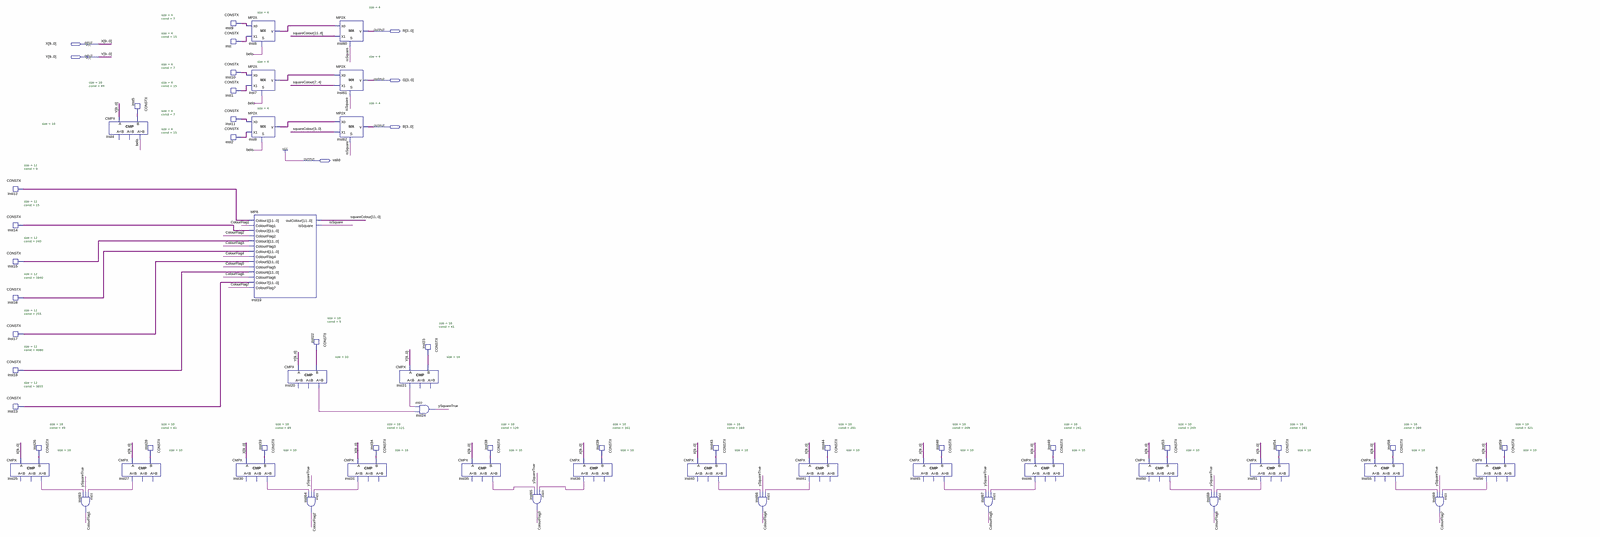
[diagram p0: schematic sheet, whole]
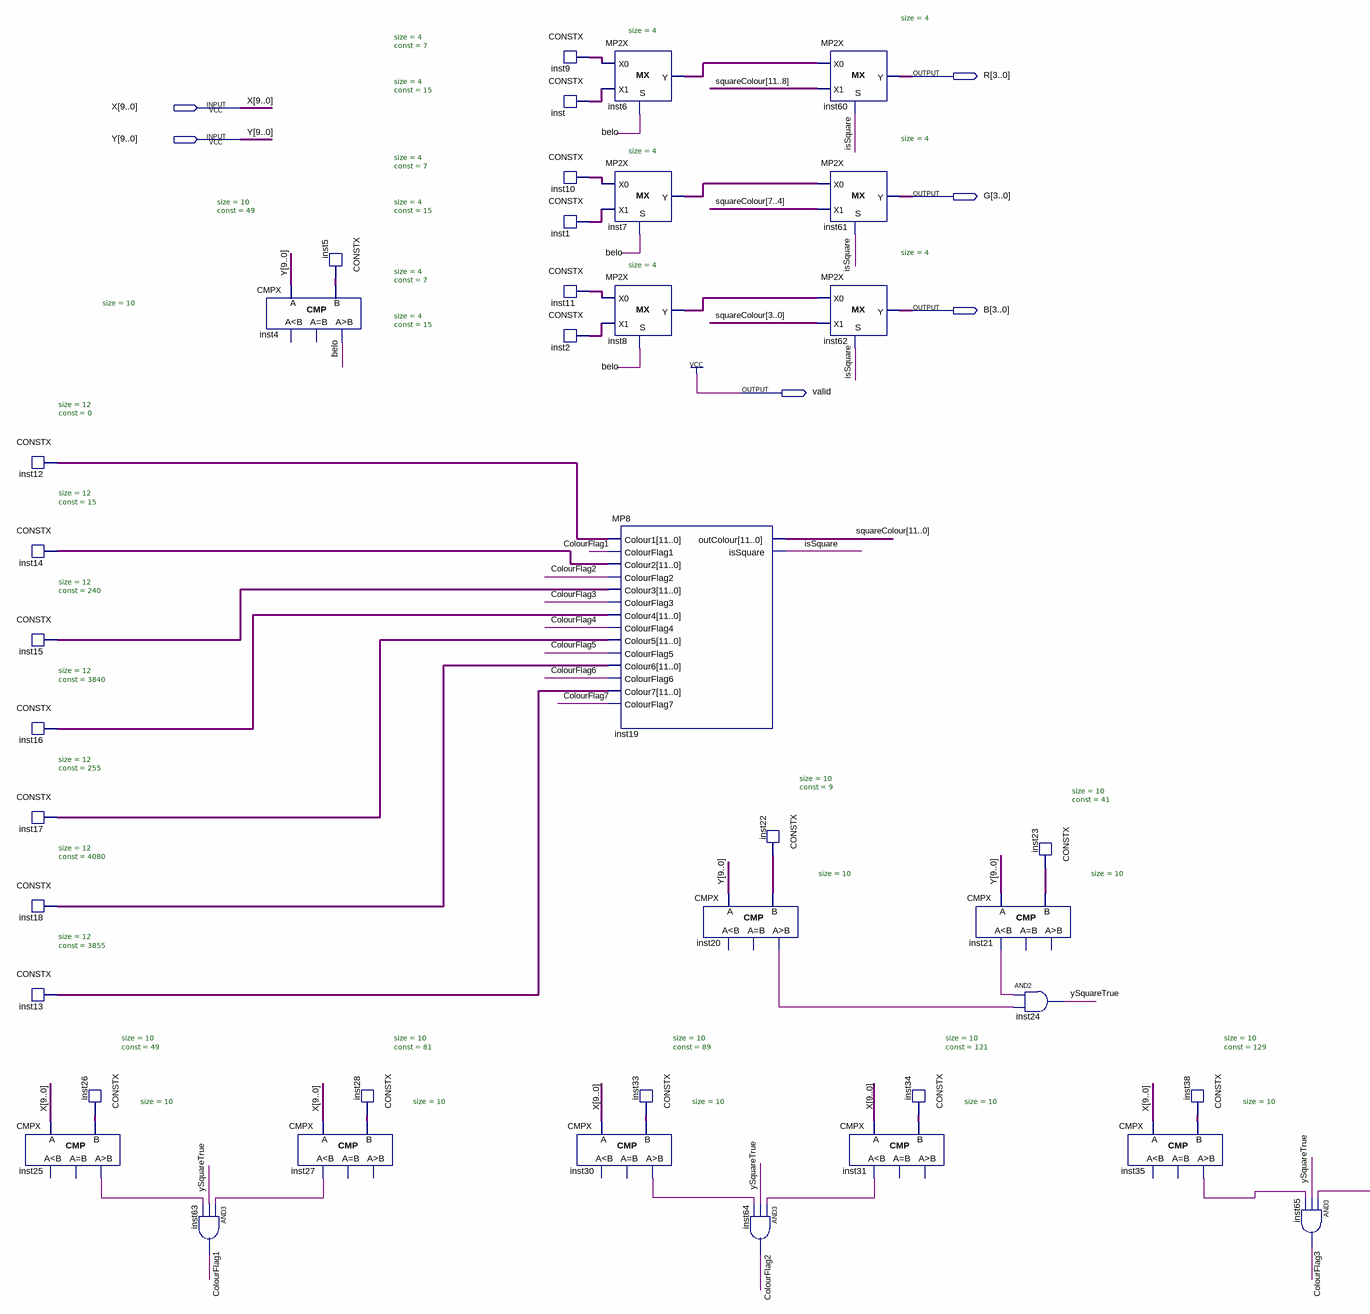
[diagram p1: schematic sheet, left part]
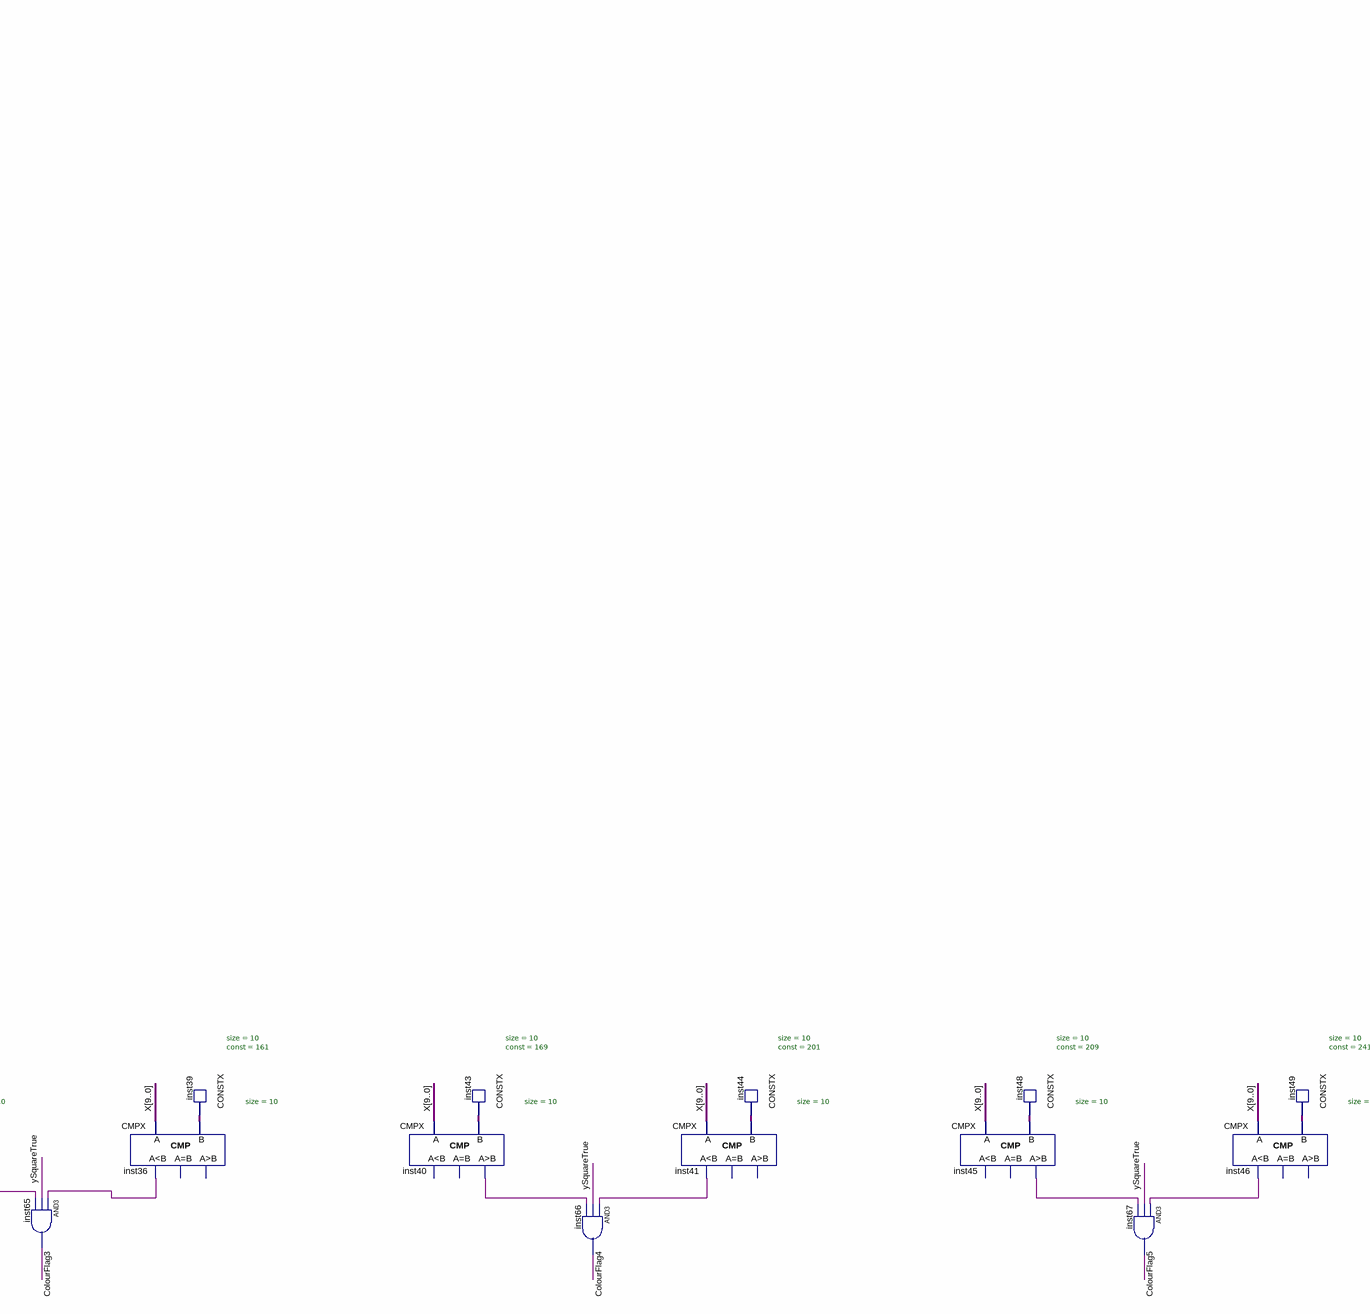
[diagram p2: schematic sheet, centre part]
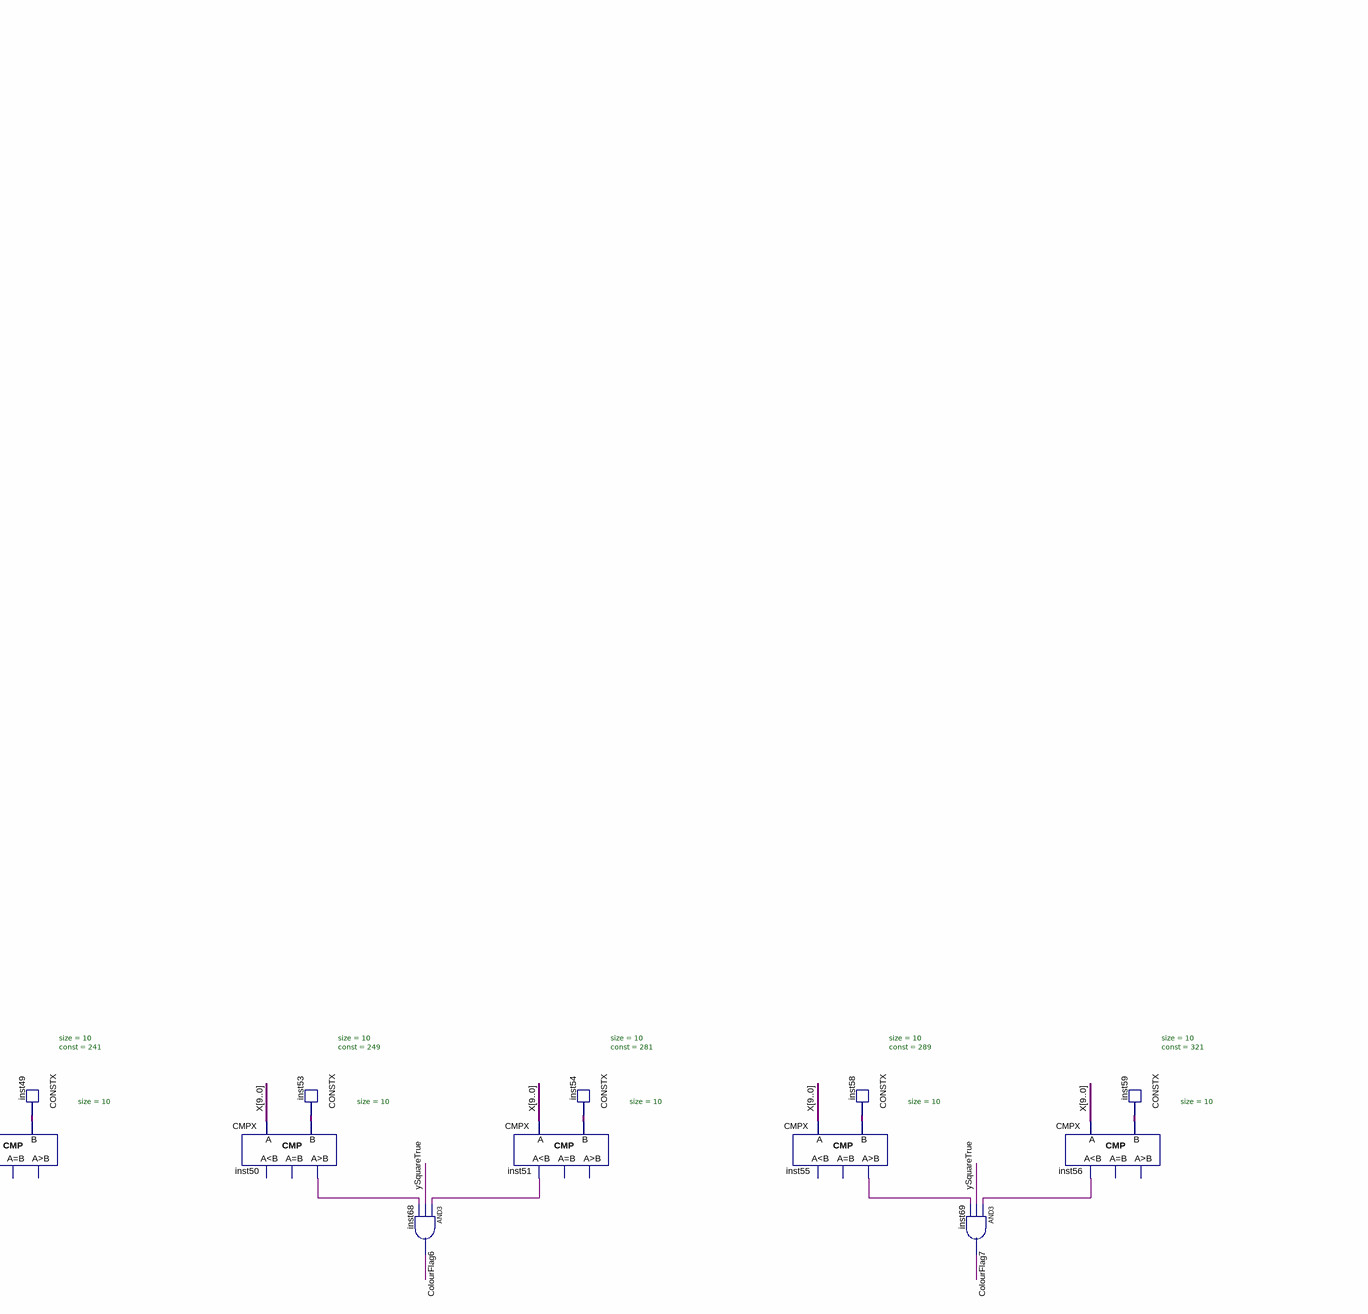
[diagram p3: schematic sheet, right part]
// Quartus schematic Layer0.bdf as structural Verilog: 62 symbols, 6 pins
module Layer0 (
  input  [9:0] X,
  input  [9:0] Y,
  output [3:0] R,
  output [3:0] G,
  output [3:0] B,
  output valid
);

  wire belo, ColourFlag1, ColourFlag2, ColourFlag3, ColourFlag4, ColourFlag5, ColourFlag6, ColourFlag7,
       inst20_gr, inst21_ls, inst25_gr, inst27_ls, inst30_gr, inst31_ls, inst35_gr, inst36_ls, inst40_gr,
       inst41_ls, inst45_gr, inst46_ls, inst50_gr, inst51_ls, inst55_gr, inst56_ls, isSquare, ySquareTrue;
  wire [3:0] inst1_data, inst2_data, inst6_y, inst7_y, inst8_y, inst9_data, inst10_data, inst11_data,
       inst_data;
  wire [9:0] inst5_data, inst22_data, inst23_data, inst26_data, inst28_data, inst33_data, inst34_data,
       inst38_data, inst39_data, inst43_data, inst44_data, inst48_data, inst49_data, inst53_data,
       inst54_data, inst58_data, inst59_data;
  wire [11:0] inst12_data, inst13_data, inst14_data, inst15_data, inst16_data, inst17_data, inst18_data,
       squareColour;

  CONSTX #(.size(12), .\const (0)) inst12 (.data(inst12_data));
  CONSTX #(.size(12), .\const (15)) inst14 (.data(inst14_data));
  CONSTX #(.size(12), .\const (240)) inst15 (.data(inst15_data));
  CONSTX #(.size(12), .\const (3840)) inst16 (.data(inst16_data));
  CONSTX #(.size(12), .\const (255)) inst17 (.data(inst17_data));
  CONSTX #(.size(12), .\const (4080)) inst18 (.data(inst18_data));
  CONSTX #(.size(12), .\const (3855)) inst13 (.data(inst13_data));
  CMPX #(.size(10)) inst25 (.A(X), .B(inst26_data), .gr(inst25_gr));  // open: ls, eq
  CONSTX #(.size(10), .\const (49)) inst26 (.data(inst26_data));
  and inst63 (ColourFlag1, inst27_ls, ySquareTrue, inst25_gr);
  CMPX #(.size(10)) inst4 (.A(Y), .B(inst5_data), .gr(belo));  // open: ls, eq
  CMPX #(.size(10)) inst27 (.A(X), .B(inst28_data), .ls(inst27_ls));  // open: eq, gr
  CONSTX #(.size(10), .\const (49)) inst5 (.data(inst5_data));
  CONSTX #(.size(10), .\const (81)) inst28 (.data(inst28_data));
  CONSTX #(.size(4), .\const (7)) inst9 (.data(inst9_data));
  CONSTX #(.size(4), .\const (15)) inst (.data(inst_data));
  CONSTX #(.size(4), .\const (7)) inst10 (.data(inst10_data));
  CONSTX #(.size(4), .\const (15)) inst1 (.data(inst1_data));
  CONSTX #(.size(4), .\const (7)) inst11 (.data(inst11_data));
  CONSTX #(.size(4), .\const (15)) inst2 (.data(inst2_data));
  CMPX #(.size(10)) inst30 (.A(X), .B(inst33_data), .gr(inst30_gr));  // open: ls, eq
  MP2X #(.size(4)) inst6 (.S(belo), .X0(inst9_data), .X1(inst_data), .Y(inst6_y));
  MP2X #(.size(4)) inst7 (.S(belo), .X0(inst10_data), .X1(inst1_data), .Y(inst7_y));
  MP2X #(.size(4)) inst8 (.S(belo), .X0(inst11_data), .X1(inst2_data), .Y(inst8_y));
  MP8 inst19 (
    .Colour1(inst12_data), .ColourFlag1(ColourFlag1), .Colour2(inst14_data), .ColourFlag2(ColourFlag2),
    .Colour3(inst15_data), .ColourFlag3(ColourFlag3), .Colour4(inst16_data), .ColourFlag4(ColourFlag4),
    .Colour5(inst17_data), .ColourFlag5(ColourFlag5), .Colour6(inst18_data), .ColourFlag6(ColourFlag6),
    .Colour7(inst13_data), .ColourFlag7(ColourFlag7), .outColour(squareColour), .isSquare(isSquare));
  CONSTX #(.size(10), .\const (89)) inst33 (.data(inst33_data));
  CMPX #(.size(10)) inst20 (.A(Y), .B(inst22_data), .gr(inst20_gr));  // open: ls, eq
  CONSTX #(.size(10), .\const (9)) inst22 (.data(inst22_data));
  and inst64 (ColourFlag2, inst31_ls, ySquareTrue, inst30_gr);
  MP2X #(.size(4)) inst60 (.S(isSquare), .X0(inst6_y), .X1(squareColour[11:8]), .Y(R));
  MP2X #(.size(4)) inst61 (.S(isSquare), .X0(inst7_y), .X1(squareColour[7:4]), .Y(G));
  MP2X #(.size(4)) inst62 (.S(isSquare), .X0(inst8_y), .X1(squareColour[3:0]), .Y(B));
  CMPX #(.size(10)) inst31 (.A(X), .B(inst34_data), .ls(inst31_ls));  // open: eq, gr
  CONSTX #(.size(10), .\const (121)) inst34 (.data(inst34_data));
  CMPX #(.size(10)) inst21 (.A(Y), .B(inst23_data), .ls(inst21_ls));  // open: eq, gr
  and inst24 (ySquareTrue, inst21_ls, inst20_gr);
  CONSTX #(.size(10), .\const (41)) inst23 (.data(inst23_data));
  CMPX #(.size(10)) inst35 (.A(X), .B(inst38_data), .gr(inst35_gr));  // open: ls, eq
  CONSTX #(.size(10), .\const (129)) inst38 (.data(inst38_data));
  and inst65 (ColourFlag3, inst36_ls, ySquareTrue, inst35_gr);
  CMPX #(.size(10)) inst36 (.A(X), .B(inst39_data), .ls(inst36_ls));  // open: eq, gr
  CONSTX #(.size(10), .\const (161)) inst39 (.data(inst39_data));
  CMPX #(.size(10)) inst40 (.A(X), .B(inst43_data), .gr(inst40_gr));  // open: ls, eq
  CONSTX #(.size(10), .\const (169)) inst43 (.data(inst43_data));
  and inst66 (ColourFlag4, inst41_ls, ySquareTrue, inst40_gr);
  CMPX #(.size(10)) inst41 (.A(X), .B(inst44_data), .ls(inst41_ls));  // open: eq, gr
  CONSTX #(.size(10), .\const (201)) inst44 (.data(inst44_data));
  CMPX #(.size(10)) inst45 (.A(X), .B(inst48_data), .gr(inst45_gr));  // open: ls, eq
  CONSTX #(.size(10), .\const (209)) inst48 (.data(inst48_data));
  and inst67 (ColourFlag5, inst46_ls, ySquareTrue, inst45_gr);
  CMPX #(.size(10)) inst46 (.A(X), .B(inst49_data), .ls(inst46_ls));  // open: eq, gr
  CONSTX #(.size(10), .\const (241)) inst49 (.data(inst49_data));
  CMPX #(.size(10)) inst50 (.A(X), .B(inst53_data), .gr(inst50_gr));  // open: ls, eq
  CONSTX #(.size(10), .\const (249)) inst53 (.data(inst53_data));
  and inst68 (ColourFlag6, inst51_ls, ySquareTrue, inst50_gr);
  CMPX #(.size(10)) inst51 (.A(X), .B(inst54_data), .ls(inst51_ls));  // open: eq, gr
  CONSTX #(.size(10), .\const (281)) inst54 (.data(inst54_data));
  CMPX #(.size(10)) inst55 (.A(X), .B(inst58_data), .gr(inst55_gr));  // open: ls, eq
  CONSTX #(.size(10), .\const (289)) inst58 (.data(inst58_data));
  and inst69 (ColourFlag7, inst56_ls, ySquareTrue, inst55_gr);
  CMPX #(.size(10)) inst56 (.A(X), .B(inst59_data), .ls(inst56_ls));  // open: eq, gr
  CONSTX #(.size(10), .\const (321)) inst59 (.data(inst59_data));

  assign valid = 1'b1;
endmodule
